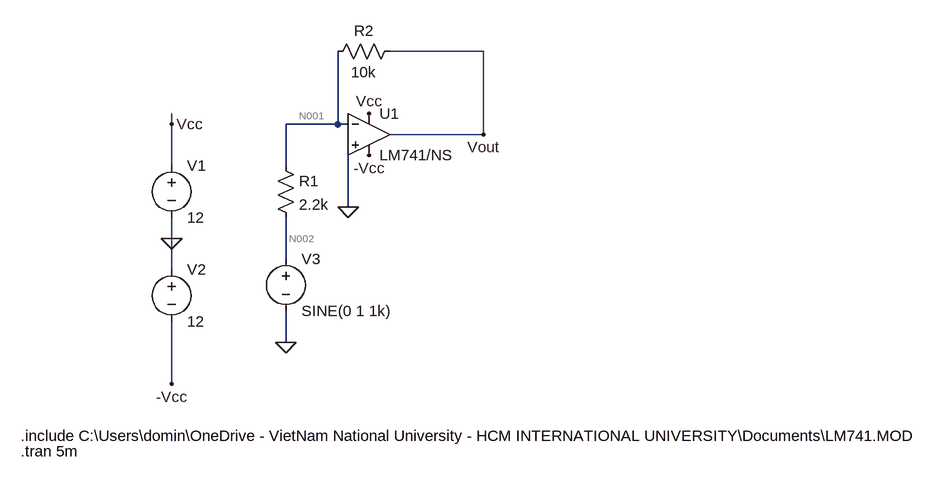
[diagram p0: schematic Draft2.asc]
Draft2.asc, the LTspice schematic file:
Version 4
SHEET 1 1668 680
WIRE 560 -240 416 -240
WIRE 80 -128 80 -144
WIRE 336 -128 336 -240
WIRE 336 -128 256 -128
WIRE 352 -128 336 -128
WIRE 560 -112 560 -240
WIRE 560 -112 416 -112
WIRE 80 -64 80 -128
WIRE 256 -64 256 -128
WIRE 352 0 352 -96
WIRE 80 48 80 16
WIRE 256 80 256 16
WIRE 80 96 80 48
WIRE 256 208 256 160
WIRE 80 272 80 176
FLAG 80 48 0
FLAG 80 -128 Vcc
FLAG 80 272 -Vcc
FLAG 384 -144 Vcc
FLAG 384 -80 -Vcc
FLAG 256 208 0
FLAG 352 0 0
FLAG 560 -112 Vout
SYMBOL voltage 80 -80 R0
WINDOW 123 0 0 Left 0
WINDOW 39 0 0 Left 0
SYMATTR InstName V1
SYMATTR Value 12
SYMBOL OpAmps\\opamp2 384 -176 R0
SYMATTR InstName U1
SYMATTR Value LM741/NS
SYMBOL voltage 80 80 R0
WINDOW 123 0 0 Left 0
WINDOW 39 0 0 Left 0
SYMATTR InstName V2
SYMATTR Value 12
SYMBOL voltage 256 64 R0
WINDOW 123 0 0 Left 0
WINDOW 39 0 0 Left 0
SYMATTR InstName V3
SYMATTR Value SINE(0 1 1k)
SYMBOL res 240 -80 R0
SYMATTR InstName R1
SYMATTR Value 2.2k
SYMBOL res 432 -256 R90
WINDOW 0 0 56 VBottom 2
WINDOW 3 32 56 VTop 2
SYMATTR InstName R2
SYMATTR Value 10k
TEXT -152 352 Left 2 !.include C:\\Users\\domin\\OneDrive - VietNam National University - HCM INTERNATIONAL UNIVERSITY\\Documents\\LM741.MOD
TEXT -152 376 Left 2 !.tran 5m

The netlist it stands for:
* Draft2.asc
V1 Vcc 0 12
XU1 0 N001 Vcc -Vcc Vout LM741/NS  ; pins In+ In- V+ V- OUT
V2 0 -Vcc 12
V3 N002 0 SINE(0 1 1k)
R1 N001 N002 2.2k
R2 Vout N001 10k
.include C:\Users\domin\OneDrive - VietNam National University - HCM INTERNATIONAL UNIVERSITY\Documents\LM741.MOD
.tran 5m
.backanno
.end

* Results of the author's LTspice run, read from the files saved beside the schematic
* Operating Point, zero values left out:
*   V(vcc) = 12 V
*   V(n001) = 1 mV
*   V(-vcc) = -12 V
*   V(vout) = 6.564 mV
*   I(R1) = 454.5 nA
*   I(R2) = 556.4 nA
*   I(V1) = -1.626 mA
*   I(V2) = -1.626 mA
*   I(V3) = 454.5 nA
*   Ix(u1:1) = 57.86 nA
*   Ix(u1:2) = 101.9 nA
*   Ix(u1:99) = 1.626 mA
*   Ix(u1:50) = -1.626 mA
*   Ix(u1:28) = -556.4 nA
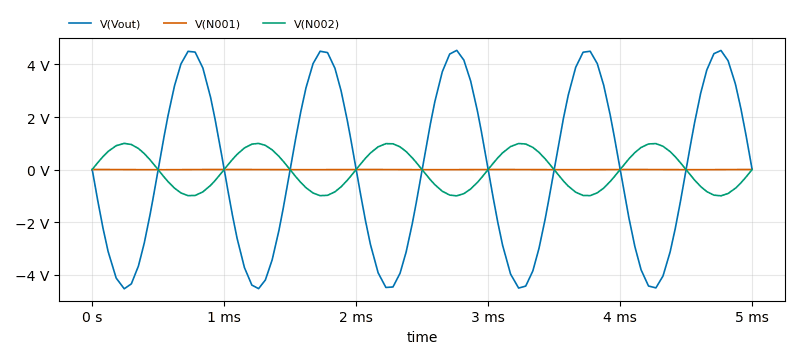
[diagram p1: Transient Analysis of Draft2.asc, plotted from the saved traces]
* Transient Analysis, 1 run:
*   V(Vout): min -4.533 V, max 4.537 V, average 6.897 mV, rms 3.199 V, last 32.44 mV
*   V(N001): min -3.637 mV, max 5.638 mV, average 998.7 µV, rms 3.422 mV, last 5.638 mV
*   V(N002): min -996.5 mV, max 999.2 mV, average -74.8 µV, rms 704 mV, last 0 V